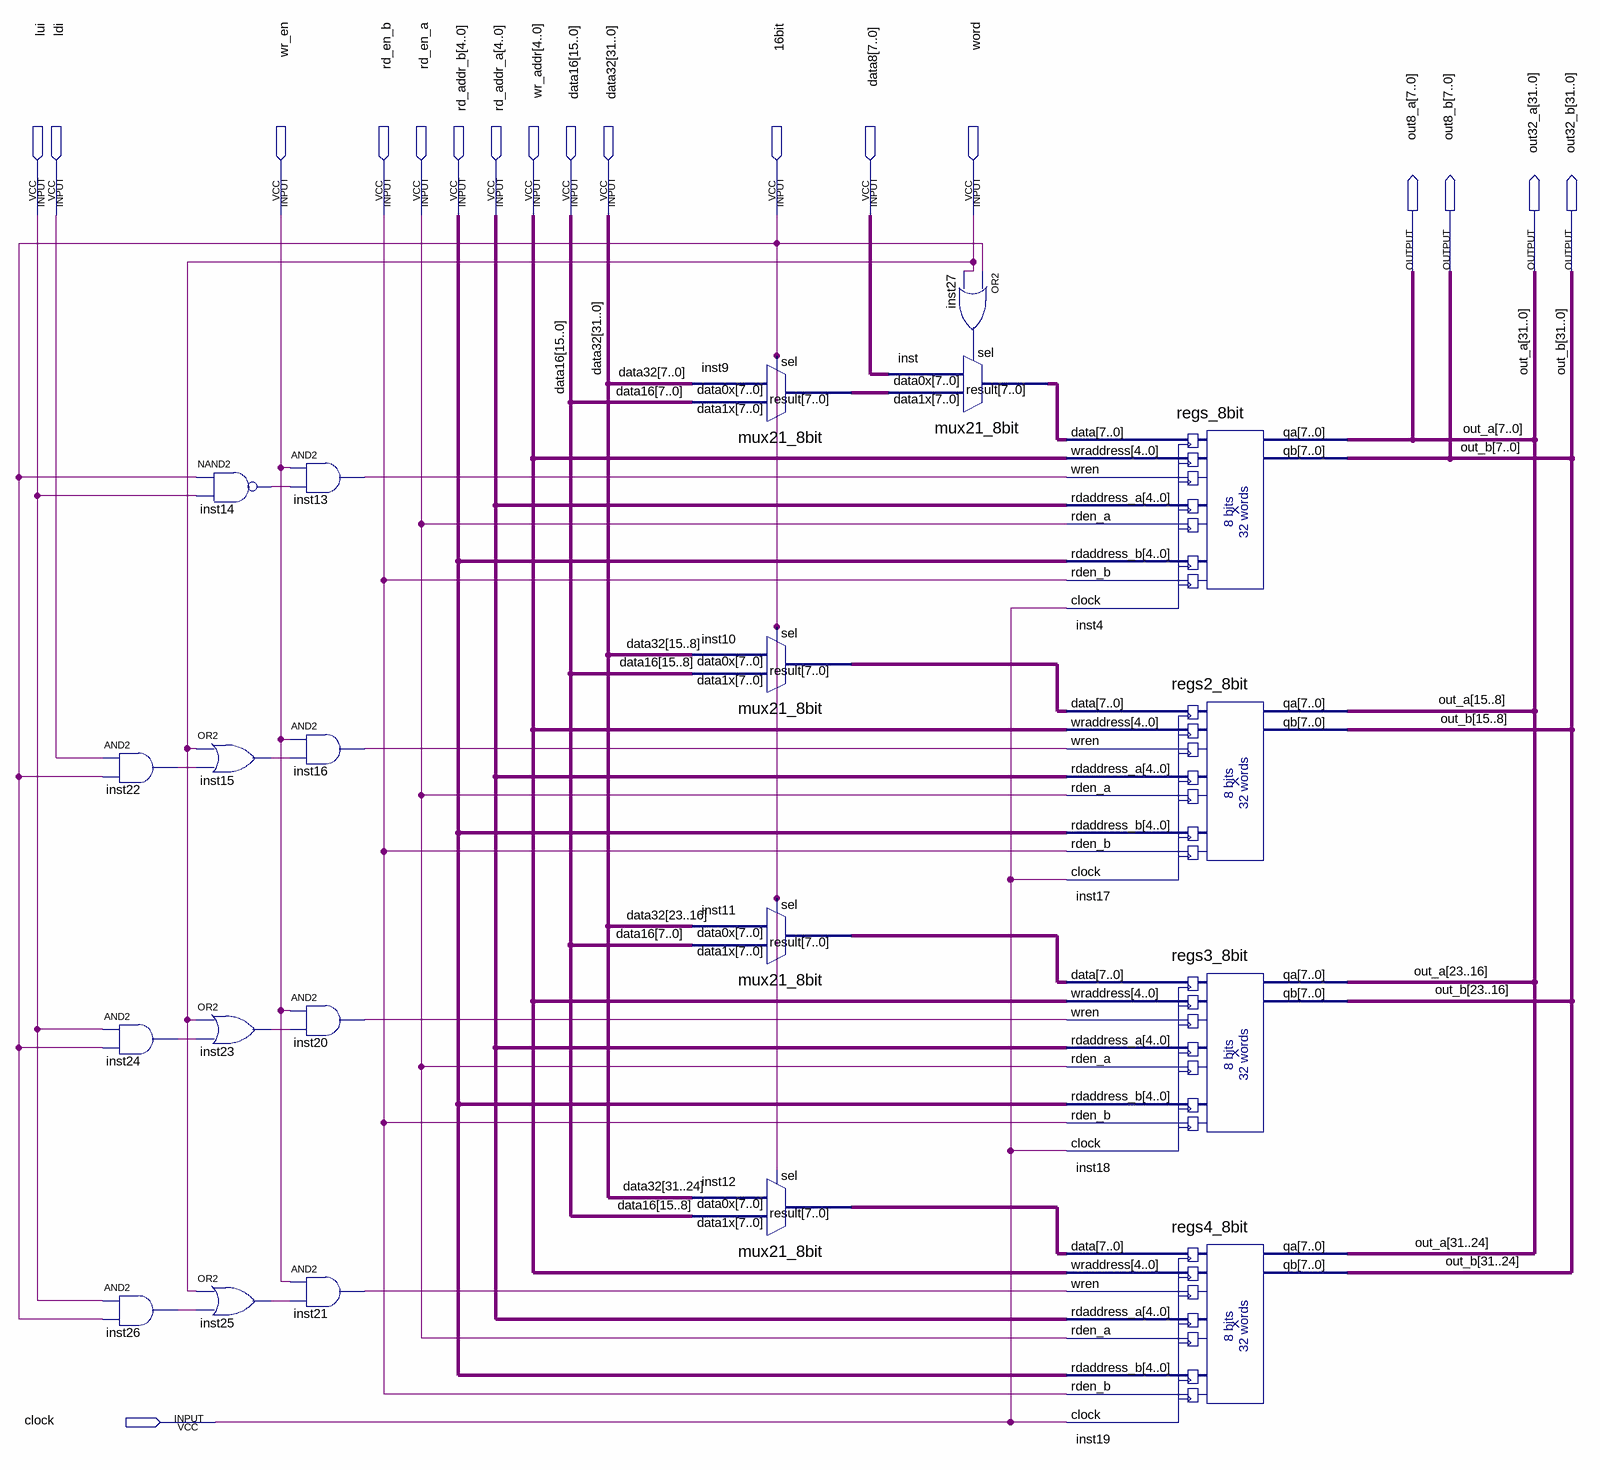
[diagram p0: schematic sheet]
// Quartus schematic registers_mem.bdf as structural Verilog: 21 symbols, 18 pins
module registers_mem (
  input  lui,
  input  ldi,
  input  wr_en,
  input  rd_en_b,
  input  rd_en_a,
  input  [4:0] rd_addr_b,
  input  [4:0] rd_addr_a,
  input  [4:0] wr_addr,
  input  [15:0] data16,
  input  [31:0] data32,
  input  \16bit ,
  input  [7:0] data8,
  input  word,
  input  clock,
  output [7:0] out8_a,
  output [7:0] out8_b,
  output [31:0] out32_a,
  output [31:0] out32_b
);

  wire inst13_out, inst14_out, inst15_out, inst16_out, inst20_out, inst21_out, inst22_out, inst23_out,
       inst24_out, inst25_out, inst26_out, inst27_out;
  wire [7:0] inst9_result, inst10_result, inst11_result, inst12_result, inst_result;

  and inst22 (inst22_out, ldi, \16bit );
  and inst24 (inst24_out, lui, \16bit );
  and inst26 (inst26_out, lui, \16bit );
  nand inst14 (inst14_out, \16bit , lui);
  or inst15 (inst15_out, word, inst22_out);
  or inst23 (inst23_out, word, inst24_out);
  or inst25 (inst25_out, word, inst26_out);
  and inst13 (inst13_out, wr_en, inst14_out);
  and inst16 (inst16_out, wr_en, inst15_out);
  and inst20 (inst20_out, wr_en, inst23_out);
  and inst21 (inst21_out, wr_en, inst25_out);
  mux21_8bit inst9 (.data1x(data16[7:0]), .data0x(data32[7:0]), .sel(\16bit ), .result(inst9_result));
  mux21_8bit inst10 (.data1x(data16[15:8]), .data0x(data32[15:8]), .sel(\16bit ), .result(inst10_result));
  mux21_8bit inst11 (.data1x(data16[7:0]), .data0x(data32[23:16]), .sel(\16bit ), .result(inst11_result));
  mux21_8bit inst12 (.data1x(data16[15:8]), .data0x(data32[31:24]), .sel(\16bit ), .result(inst12_result));
  or inst27 (inst27_out, \16bit , word);
  mux21_8bit inst (.data1x(inst9_result), .data0x(data8), .sel(inst27_out), .result(inst_result));
  regs_8bit inst4 (
    .data(inst_result), .wraddress(wr_addr), .wren(inst13_out), .rdaddress_a(rd_addr_a), .rden_a(rd_en_a),
    .rdaddress_b(rd_addr_b), .rden_b(rd_en_b), .clock(clock), .qa(out8_a), .qb(out8_b));
  regs2_8bit inst17 (
    .data(inst10_result), .wraddress(wr_addr), .wren(inst16_out), .rdaddress_a(rd_addr_a), .rden_a(rd_en_a),
    .rdaddress_b(rd_addr_b), .rden_b(rd_en_b), .clock(clock), .qa(out32_a[15:8]), .qb(out32_b[15:8]));
  regs3_8bit inst18 (
    .data(inst11_result), .wraddress(wr_addr), .wren(inst20_out), .rdaddress_a(rd_addr_a), .rden_a(rd_en_a),
    .rdaddress_b(rd_addr_b), .rden_b(rd_en_b), .clock(clock), .qa(out32_a[23:16]), .qb(out32_b[23:16]));
  regs4_8bit inst19 (
    .data(inst12_result), .wraddress(wr_addr), .wren(inst21_out), .rdaddress_a(rd_addr_a), .rden_a(rd_en_a),
    .rdaddress_b(rd_addr_b), .rden_b(rd_en_b), .clock(clock), .qa(out32_a[31:24]), .qb(out32_b[31:24]));

  assign out32_a[7:0] = out8_a;
  assign out32_b[7:0] = out8_b;

  // Other names for the same wires on the sheet: out_a[31:0] = {out32_a[31:8], out8_a};
  //   out_b[31:0] = {out32_b[31:8], out8_b}
endmodule
